# EAGLE design brick_3pin_led_1x1 (EAGLE 7.3.0)
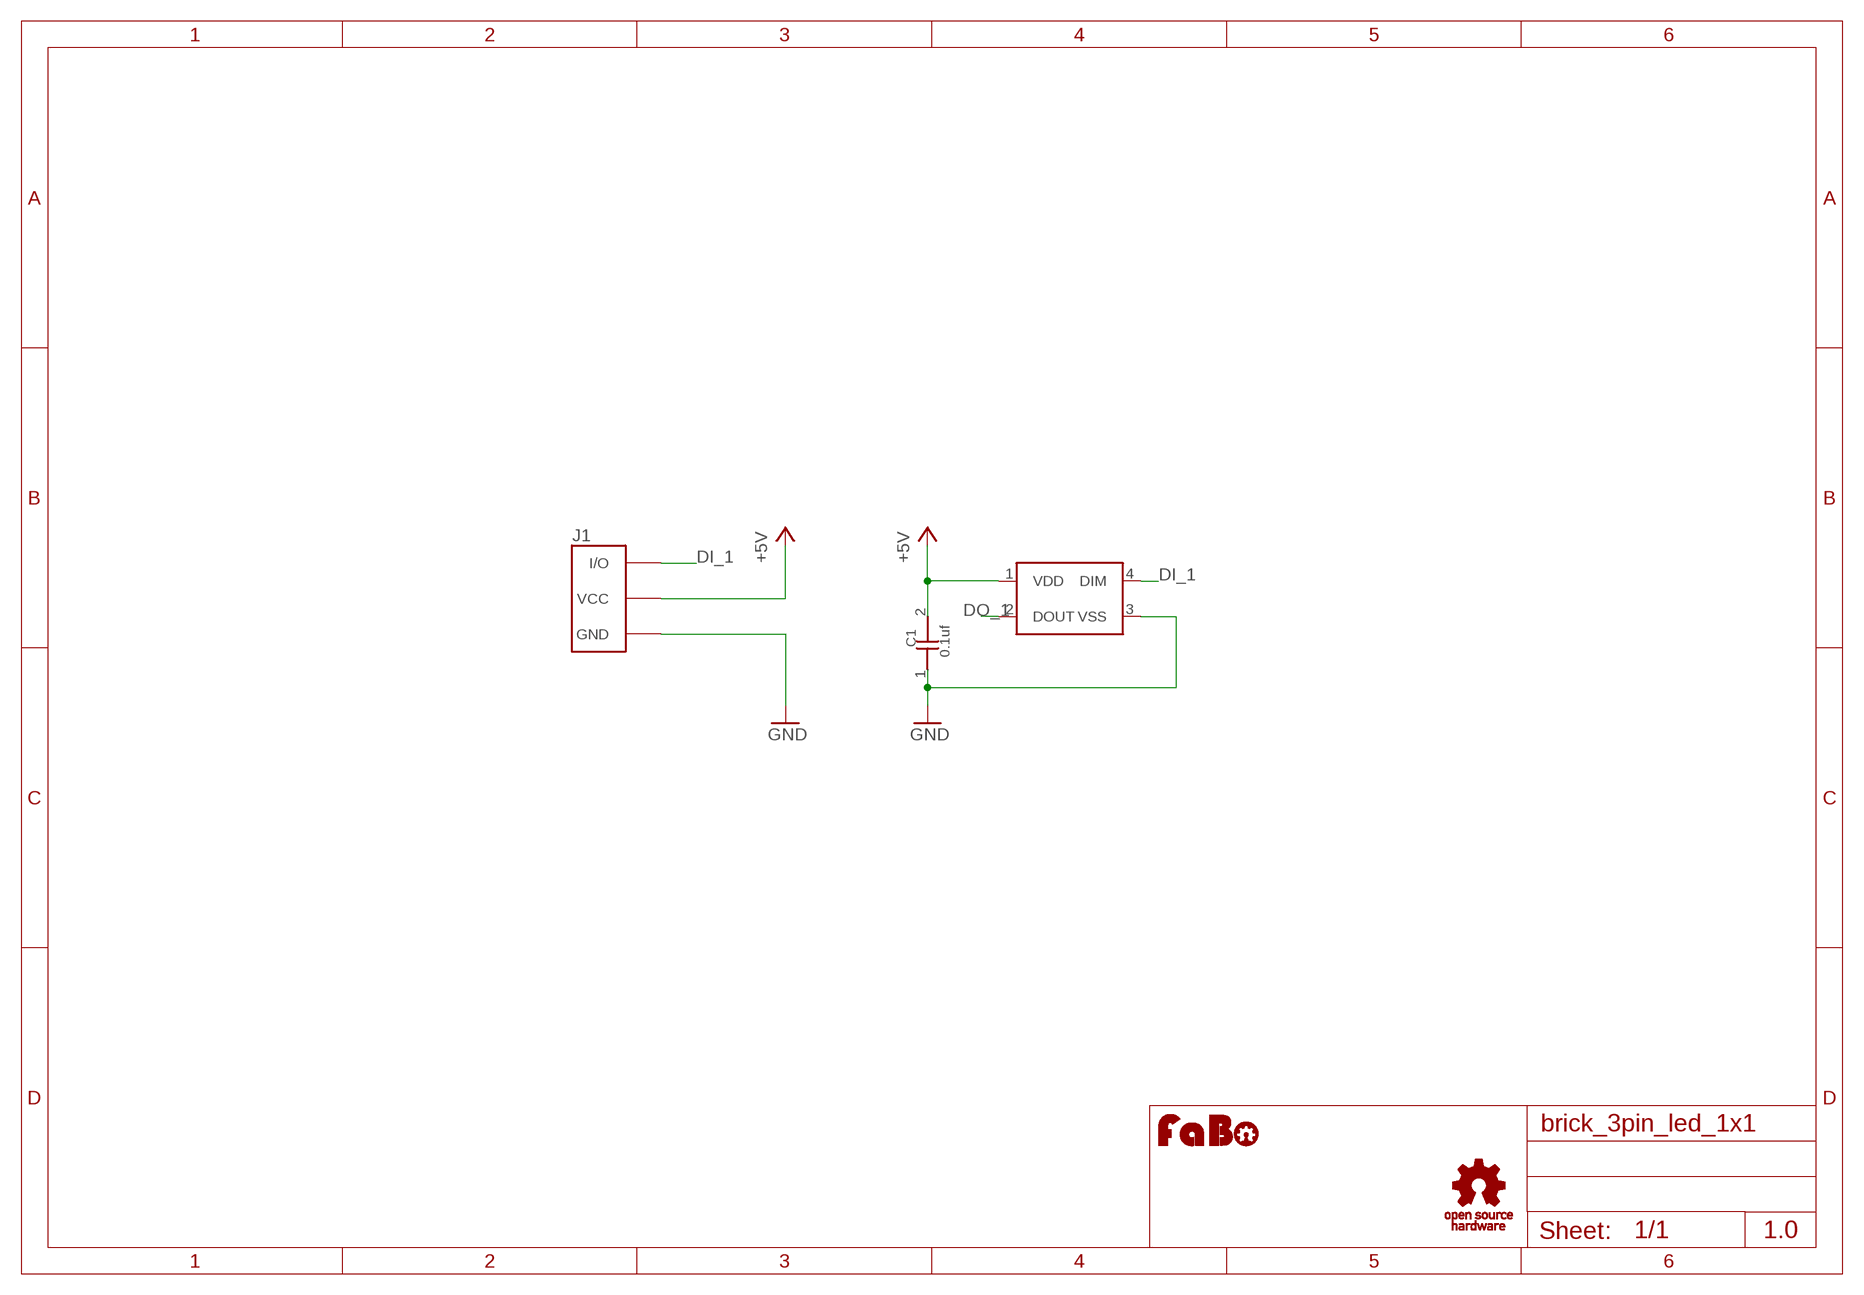
[diagram p0: schematic, sheet 1]

## Parts
C1  0.1uf  CAPACITOR0603  [0603]
J1  BRICK_3PIN_NORMAL  [BRICK_3PIN]
LED1  WS2818B  [WS2818B]
U$4  LOGO_FABO-M  [LOGO_FABO_M]
U$5  LOGO_OSHW_T-M  [LOGO_OSHW_T_M]

## Nets
+5V: C1.2 J1.VCC LED1.1(VDD)
DI_1: J1.IN/OUT(I/O) LED1.4(DIM)
DO_1: LED1.2(DOUT)
GND: C1.1 J1.GND LED1.3(VSS)

## Notes on the sheet
- 1.0

## Library data of the parts
C1 = GClue-Capacitor:CAPACITOR
J1 = GClue:BRICK_3PIN: FaBo Brick 3pin
LED1 = GClue-LED:WS2818B
U$4 = FaBo:LOGO_FABO
U$5 = GClue:LOGO_OSHW_T

## Board
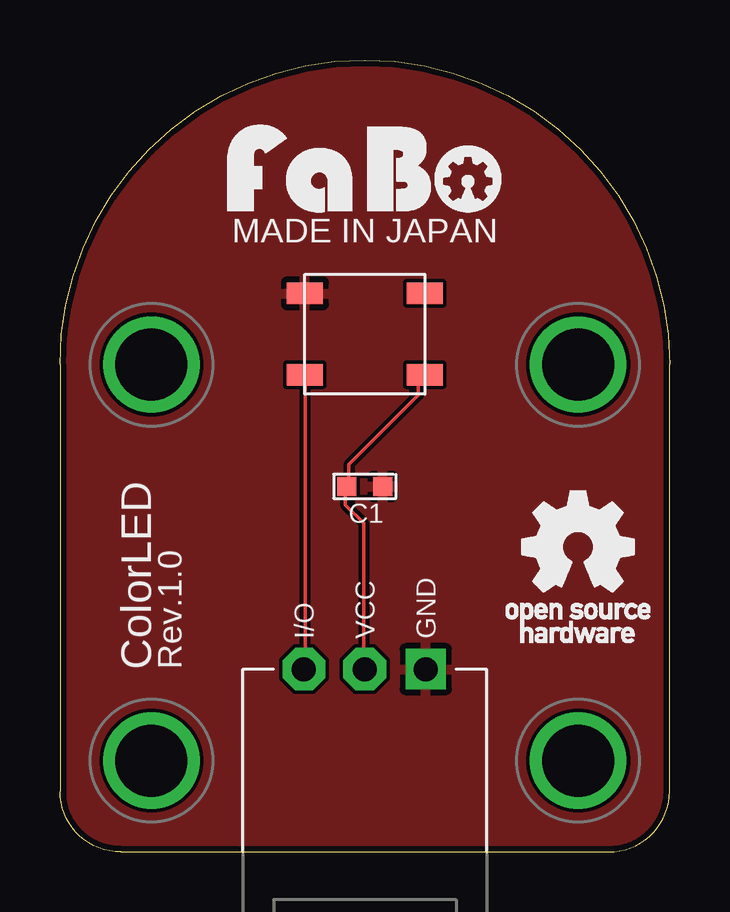
[diagram p1: board, top side]
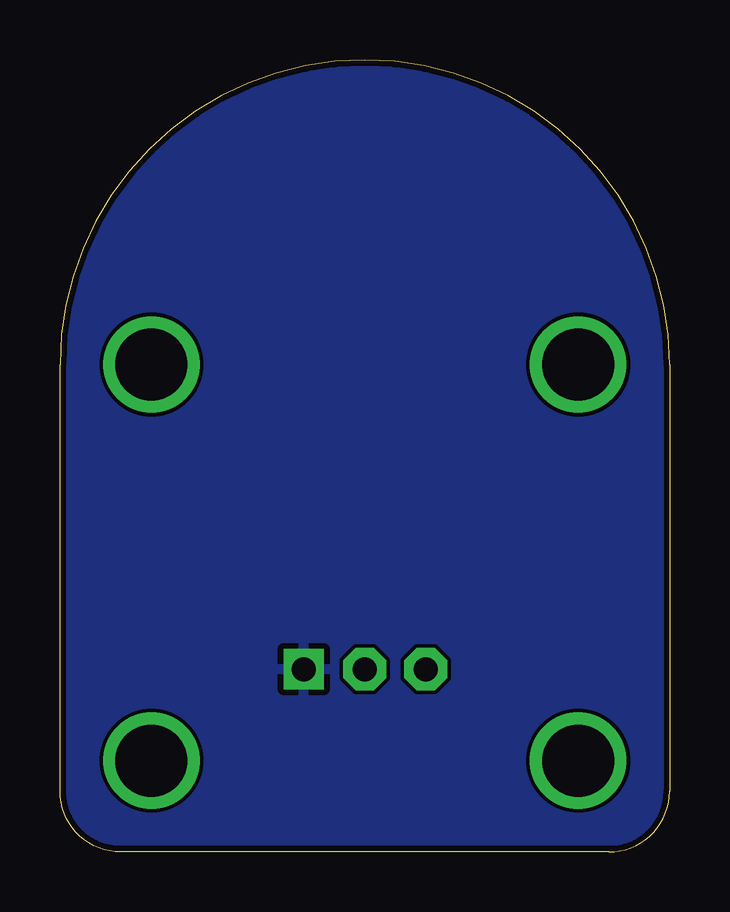
[diagram p2: board, bottom side, seen from below]

Size 25.4 x 33.02 mm. Coordinates in mm from the lower left corner, seen from the top.
Copper layers (1*16): Top 0.035mm / dielectric 1.5mm / Bottom 0.035mm
Design rules "Elecrow_2-layer_eagle_rule": minimum track width 6mil, minimum drill 12mil, track to track 6mil, track to pad 6mil, pad to pad 6mil, via to via 6mil, smd to smd 0mil, copper to edge 10mil, drill to drill 10mil, minimum pad ring 10mil, minimum via ring 6mil, stop-mask expansion 2mil, vias tented up to drill 100mil, thermal gap 10mil

### Footprints (pad centres in the part's own frame; a part is rotated, then mirrored left to right if it is on the bottom)
0603 = smd 0.8 x 0.8: 1 -0.75,0; 2 0.75,0
BRICK_3PIN = drill 1 pad 1.676 square: GND 2.54,-8.89 | drill 1 pad 1.778 octagon: IN/OUT -2.54,-8.89; VCC 0,-8.89 | drill 3 pad 3.81: P$5 -8.89,3.81; P$6 8.89,3.81; P$7 -8.89,-12.7; P$8 8.89,-12.7
WS2818B = smd 1.5 x 0.9: 1 -2.5,1.7; 2 -2.5,-1.7; 3 2.5,-1.7; 4 2.5,1.7

### Placement (x,y rotation side)
C1  12.7,15.24 180 top
J1  12.7,16.51 0 top
LED1  12.7,21.59 180 top
U$4  12.7,26.67 0 top
U$5  21.59,12.7 0 top

### Tracks (layer width: path | path; a pad name or v marks a point on that pad's centre or on a via)
+5V
  Top 0.152: LED1.1 15.09,19.81 14.94,19.66 14.94,19.05 12.04,16.15 12.04,15.24 C1.2 11.89,15.24 11.89,14.48 12.65,13.72 12.65,7.62 J1.VCC
DI_1
  Top 0.152: LED1.4 10.21,19.81 10.21,7.62 J1.IN/OUT
GND
  pour Bottom: -1.27,-1.27 26.67,-1.27 26.67,34.29 -1.27,34.29
  pour Top: -1.27,-1.27 26.67,-1.27 26.67,34.29 -1.27,34.29

### Text on the board
tPlace: MADE IN JAPAN | ColorLED | Rev.1.0